# Altium schematic sheet Module_main.SchDoc
size 410 x 297 mm
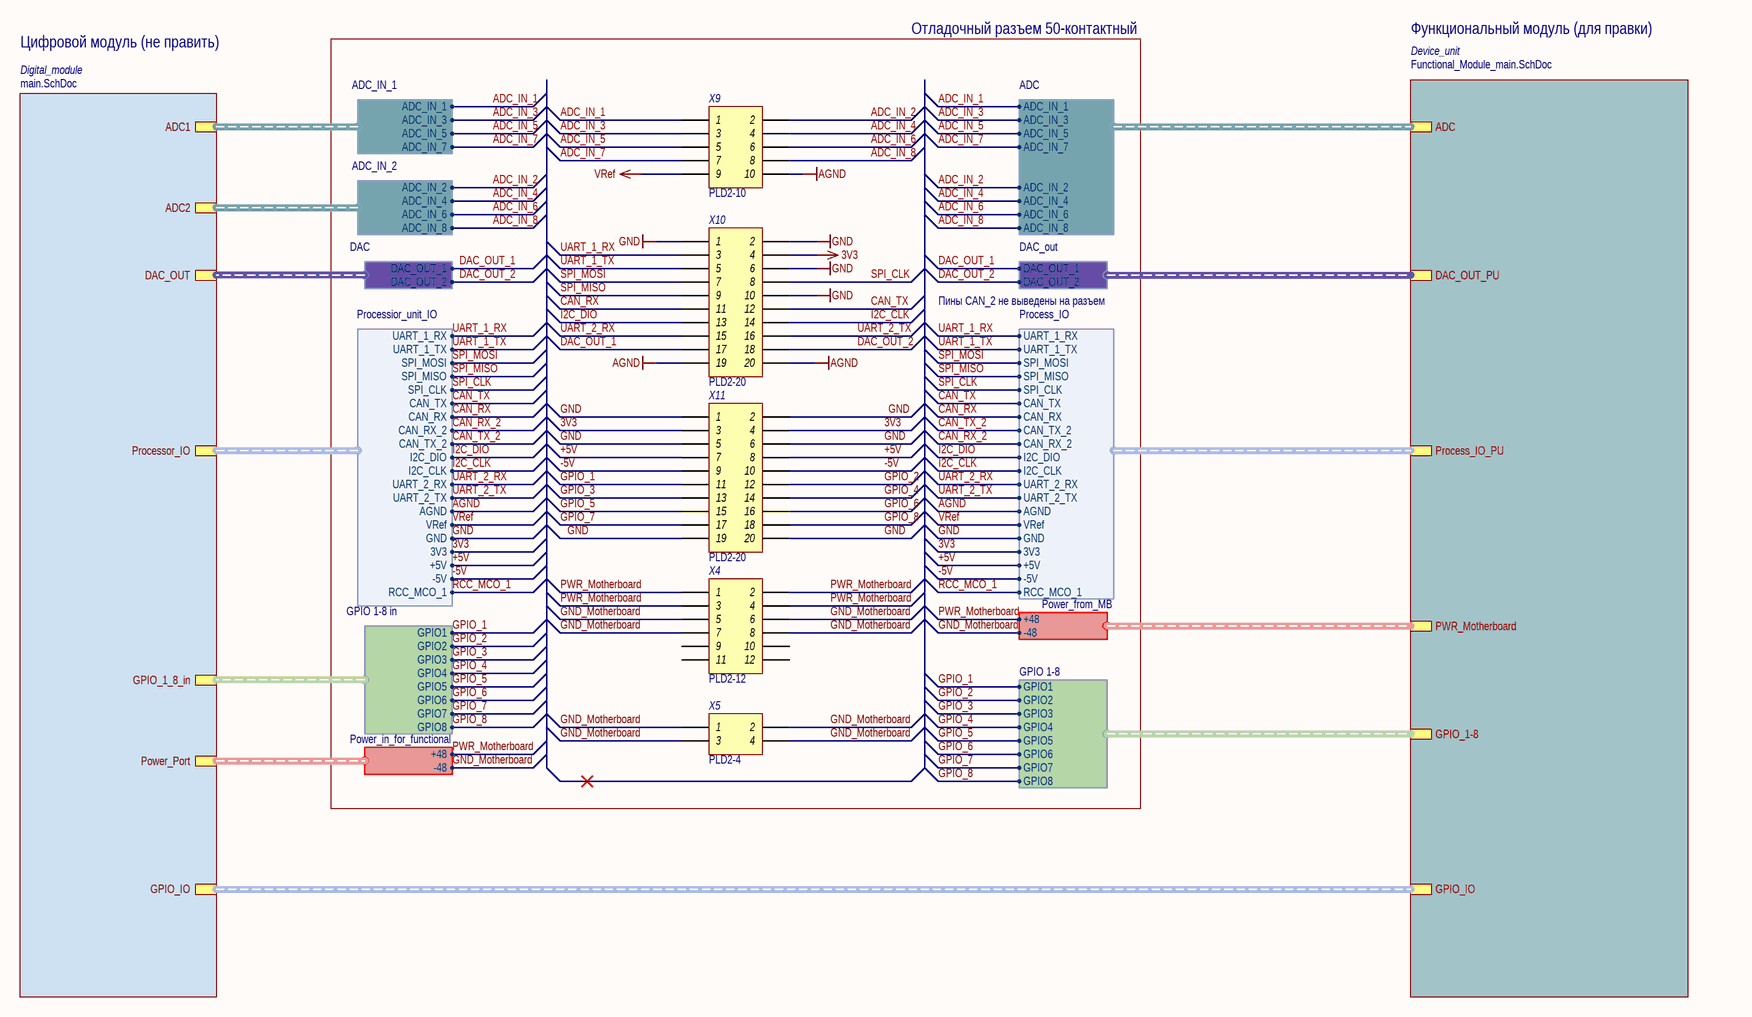
[diagram p0: Module_main.SchDoc]

## Parts
X4  Header 2X6  [PLD2-12R 2.54]  (value not drawn)
X5  Header 2X4  [PLD2-4 R 2.54]  (value not drawn)
X9  Header 2X10  [PBD2-10s]  (value not drawn)
X10  Header 2X10  [PBD2-20s]  (value not drawn)
X11  Header 2X10  [PBD2-20s]  (value not drawn)

## Sub-sheets
Device_unit = Functional_Module_main.SchDoc: GPIO_1-8 (harness GPIO 1-8), Process_IO_PU (harness Process_IO), DAC_OUT_PU (harness DAC_out), ADC (harness ADC), PWR_Motherboard (harness Power_from_MB), GPIO_IO (harness GPIO)
Digital_module = main.SchDoc: ADC2 (harness ADC_IN_2), DAC_OUT (harness DAC), Processor_IO (harness Processior_unit_IO), ADC1 (harness ADC_IN_1), Power_Port (harness Power_in_for_functional), GPIO_IO (harness GPIO), GPIO_1_8_in (harness GPIO 1-8 in)

## Harnesses
ADC_IN_1: ADC_IN_1, ADC_IN_3, ADC_IN_7, ADC_IN_5
ADC_IN_2: ADC_IN_8, ADC_IN_6, ADC_IN_4, ADC_IN_2
Processior_unit_IO: UART_1_RX, UART_1_TX, SPI_MOSI, SPI_MISO, SPI_CLK, CAN_TX, CAN_RX, I2C_DIO, I2C_CLK, UART_2_RX, UART_2_TX, AGND, VRef, GND, 3V3, +5V, -5V, CAN_RX_2, CAN_TX_2, RCC_MCO_1
DAC: DAC_OUT_1, DAC_OUT_2
GPIO 1-8 in: GPIO1, GPIO2, GPIO3, GPIO4, GPIO5, GPIO6, GPIO7, GPIO8
Process_IO: UART_1_RX, UART_1_TX, SPI_MOSI, SPI_MISO, SPI_CLK, CAN_TX, CAN_RX, I2C_DIO, I2C_CLK, UART_2_RX, UART_2_TX, AGND, VRef, GND, 3V3, +5V, -5V, CAN_TX_2, CAN_RX_2, RCC_MCO_1
ADC: ADC_IN_1, ADC_IN_3, ADC_IN_7, ADC_IN_5, ADC_IN_2, ADC_IN_4, ADC_IN_6, ADC_IN_8
DAC_out: DAC_OUT_1, DAC_OUT_2
GPIO 1-8: GPIO1, GPIO2, GPIO3, GPIO4, GPIO5, GPIO6, GPIO7, GPIO8
Power_in_for_functional: +48, -48
Power_from_MB: -48, +48

## Nets
3V3: X10.4 X11.3 X11.4 ; sheet Digital_module/Processor_IO.3V3, sheet Device_unit/Process_IO_PU.3V3
AGND: X9.10 X10.19 X10.20 ; sheet Digital_module/Processor_IO.AGND, sheet Device_unit/Process_IO_PU.AGND
GND: X10.1 X10.2 X10.6 X10.10 X11.1 X11.2 X11.5 X11.6 X11.19 X11.20 ; sheet Digital_module/Processor_IO.GND, sheet Device_unit/Process_IO_PU.GND
VRef: X9.9 ; sheet Digital_module/Processor_IO.VRef, sheet Device_unit/Process_IO_PU.VRef
+5V: X11.7 X11.8 ; sheet Digital_module/Processor_IO.+5V, sheet Device_unit/Process_IO_PU.+5V
-5V: X11.9 X11.10 ; sheet Digital_module/Processor_IO.-5V, sheet Device_unit/Process_IO_PU.-5V
ADC_IN_1: X9.1 ; sheet Digital_module/ADC1.ADC_IN_1, sheet Device_unit/ADC.ADC_IN_1
ADC_IN_2: X9.2 ; sheet Digital_module/ADC2.ADC_IN_2, sheet Device_unit/ADC.ADC_IN_2
ADC_IN_3: X9.3 ; sheet Digital_module/ADC1.ADC_IN_3, sheet Device_unit/ADC.ADC_IN_3
ADC_IN_4: X9.4 ; sheet Digital_module/ADC2.ADC_IN_4, sheet Device_unit/ADC.ADC_IN_4
ADC_IN_5: X9.5 ; sheet Digital_module/ADC1.ADC_IN_5, sheet Device_unit/ADC.ADC_IN_5
ADC_IN_6: X9.6 ; sheet Digital_module/ADC2.ADC_IN_6, sheet Device_unit/ADC.ADC_IN_6
ADC_IN_7: X9.7 ; sheet Digital_module/ADC1.ADC_IN_7, sheet Device_unit/ADC.ADC_IN_7
ADC_IN_8: X9.8 ; sheet Digital_module/ADC2.ADC_IN_8, sheet Device_unit/ADC.ADC_IN_8
CAN_RX: X10.11 ; sheet Digital_module/Processor_IO.CAN_RX, sheet Device_unit/Process_IO_PU.CAN_RX
CAN_RX_2: sheet Digital_module/Processor_IO.CAN_RX_2, sheet Device_unit/Process_IO_PU.CAN_RX_2
CAN_TX: X10.12 ; sheet Digital_module/Processor_IO.CAN_TX, sheet Device_unit/Process_IO_PU.CAN_TX
CAN_TX_2: sheet Digital_module/Processor_IO.CAN_TX_2, sheet Device_unit/Process_IO_PU.CAN_TX_2
DAC_OUT_1: X10.17 ; sheet Digital_module/DAC_OUT.DAC_OUT_1, sheet Device_unit/DAC_OUT_PU.DAC_OUT_1
DAC_OUT_2: X10.18 ; sheet Digital_module/DAC_OUT.DAC_OUT_2, sheet Device_unit/DAC_OUT_PU.DAC_OUT_2
GND_Motherboard: X4.5 X4.6 X4.7 X4.8 X5.1 X5.2 X5.3 X5.4 ; sheet Digital_module/Power_Port.-48, sheet Device_unit/PWR_Motherboard.-48
GPIO_1: X11.11 ; sheet Digital_module/GPIO_1_8_in.GPIO1, sheet Device_unit/GPIO_1-8.GPIO1
GPIO_2: X11.12 ; sheet Digital_module/GPIO_1_8_in.GPIO2, sheet Device_unit/GPIO_1-8.GPIO2
GPIO_3: X11.13 ; sheet Digital_module/GPIO_1_8_in.GPIO3, sheet Device_unit/GPIO_1-8.GPIO3
GPIO_4: X11.14 ; sheet Digital_module/GPIO_1_8_in.GPIO4, sheet Device_unit/GPIO_1-8.GPIO4
GPIO_5: X11.15 ; sheet Digital_module/GPIO_1_8_in.GPIO5, sheet Device_unit/GPIO_1-8.GPIO5
GPIO_6: X11.16 ; sheet Digital_module/GPIO_1_8_in.GPIO6, sheet Device_unit/GPIO_1-8.GPIO6
GPIO_7: X11.17 ; sheet Digital_module/GPIO_1_8_in.GPIO7, sheet Device_unit/GPIO_1-8.GPIO7
GPIO_8: X11.18 ; sheet Digital_module/GPIO_1_8_in.GPIO8, sheet Device_unit/GPIO_1-8.GPIO8
I2C_CLK: X10.14 ; sheet Digital_module/Processor_IO.I2C_CLK, sheet Device_unit/Process_IO_PU.I2C_CLK
I2C_DIO: X10.13 ; sheet Digital_module/Processor_IO.I2C_DIO, sheet Device_unit/Process_IO_PU.I2C_DIO
PWR_Motherboard: X4.1 X4.2 X4.3 X4.4 ; sheet Digital_module/Power_Port.+48, sheet Device_unit/PWR_Motherboard.+48
RCC_MCO_1: sheet Digital_module/Processor_IO.RCC_MCO_1, sheet Device_unit/Process_IO_PU.RCC_MCO_1
SPI_CLK: X10.8 ; sheet Digital_module/Processor_IO.SPI_CLK, sheet Device_unit/Process_IO_PU.SPI_CLK
SPI_MISO: X10.9 ; sheet Digital_module/Processor_IO.SPI_MISO, sheet Device_unit/Process_IO_PU.SPI_MISO
SPI_MOSI: X10.7 ; sheet Digital_module/Processor_IO.SPI_MOSI, sheet Device_unit/Process_IO_PU.SPI_MOSI
UART_1_RX: X10.3 ; sheet Digital_module/Processor_IO.UART_1_RX, sheet Device_unit/Process_IO_PU.UART_1_RX
UART_1_TX: X10.5 ; sheet Digital_module/Processor_IO.UART_1_TX, sheet Device_unit/Process_IO_PU.UART_1_TX
UART_2_RX: X10.15 ; sheet Digital_module/Processor_IO.UART_2_RX, sheet Device_unit/Process_IO_PU.UART_2_RX
UART_2_TX: X10.16 ; sheet Digital_module/Processor_IO.UART_2_TX, sheet Device_unit/Process_IO_PU.UART_2_TX

Not connected (* = marked no-connect by the designer): X4 9 10 11 12

## Buses and harness runs
harness sheet Device_unit/GPIO_IO = sheet Digital_module/GPIO_IO

## Notes on the sheet
- Цифровой модуль (не править)
- Отладочный разъем 50-контактный
- Функциональный модуль (для правки)
- Пины CAN_2 не выведены на разъем
- Перв. примен.
- Справ. №
- Подп. и дата
- Инв. № дубл.
- Взам. инв. №
- Изм.
- Разраб.
- Лист
- № докум.
- Подп.
- Дата
- Литера
- Масса
- Масштаб
- Пров.
- Т.контр.
- Листов
- Н.контр.
- Утв.
- Инв. № подл.
- Форма 1 ГОСТ 2.104-2006
- Копировал
- Формат А3

## Library data of the parts
X4 = PLD2-12: Header, 12-Pin, Dual row; Потребление, Вт: 0,0; Назначение: Header, 12-Pin, Dual row; Наименование: PLD2-12
X5 = PLD2-4: Header, 4-Pin, Dual row; Потребление, Вт: 0,0; Назначение: Header, 4-Pin, Dual row; Наименование: PLD2-4
X9 = PLD2-10: Header, 10-Pin, Dual row; Потребление, Вт: 0,0; Назначение: Header, 10-Pin, Dual row; Наименование: PLD2-10
X10 X11 = PLD2-20: Header, 12-Pin, Dual row; Назначение: Header, 20-Pin, Dual row; Потребление, Вт: 0,0; Наименование: PLD2-20